# EAGLE design W640J (EAGLE 6.6.0)
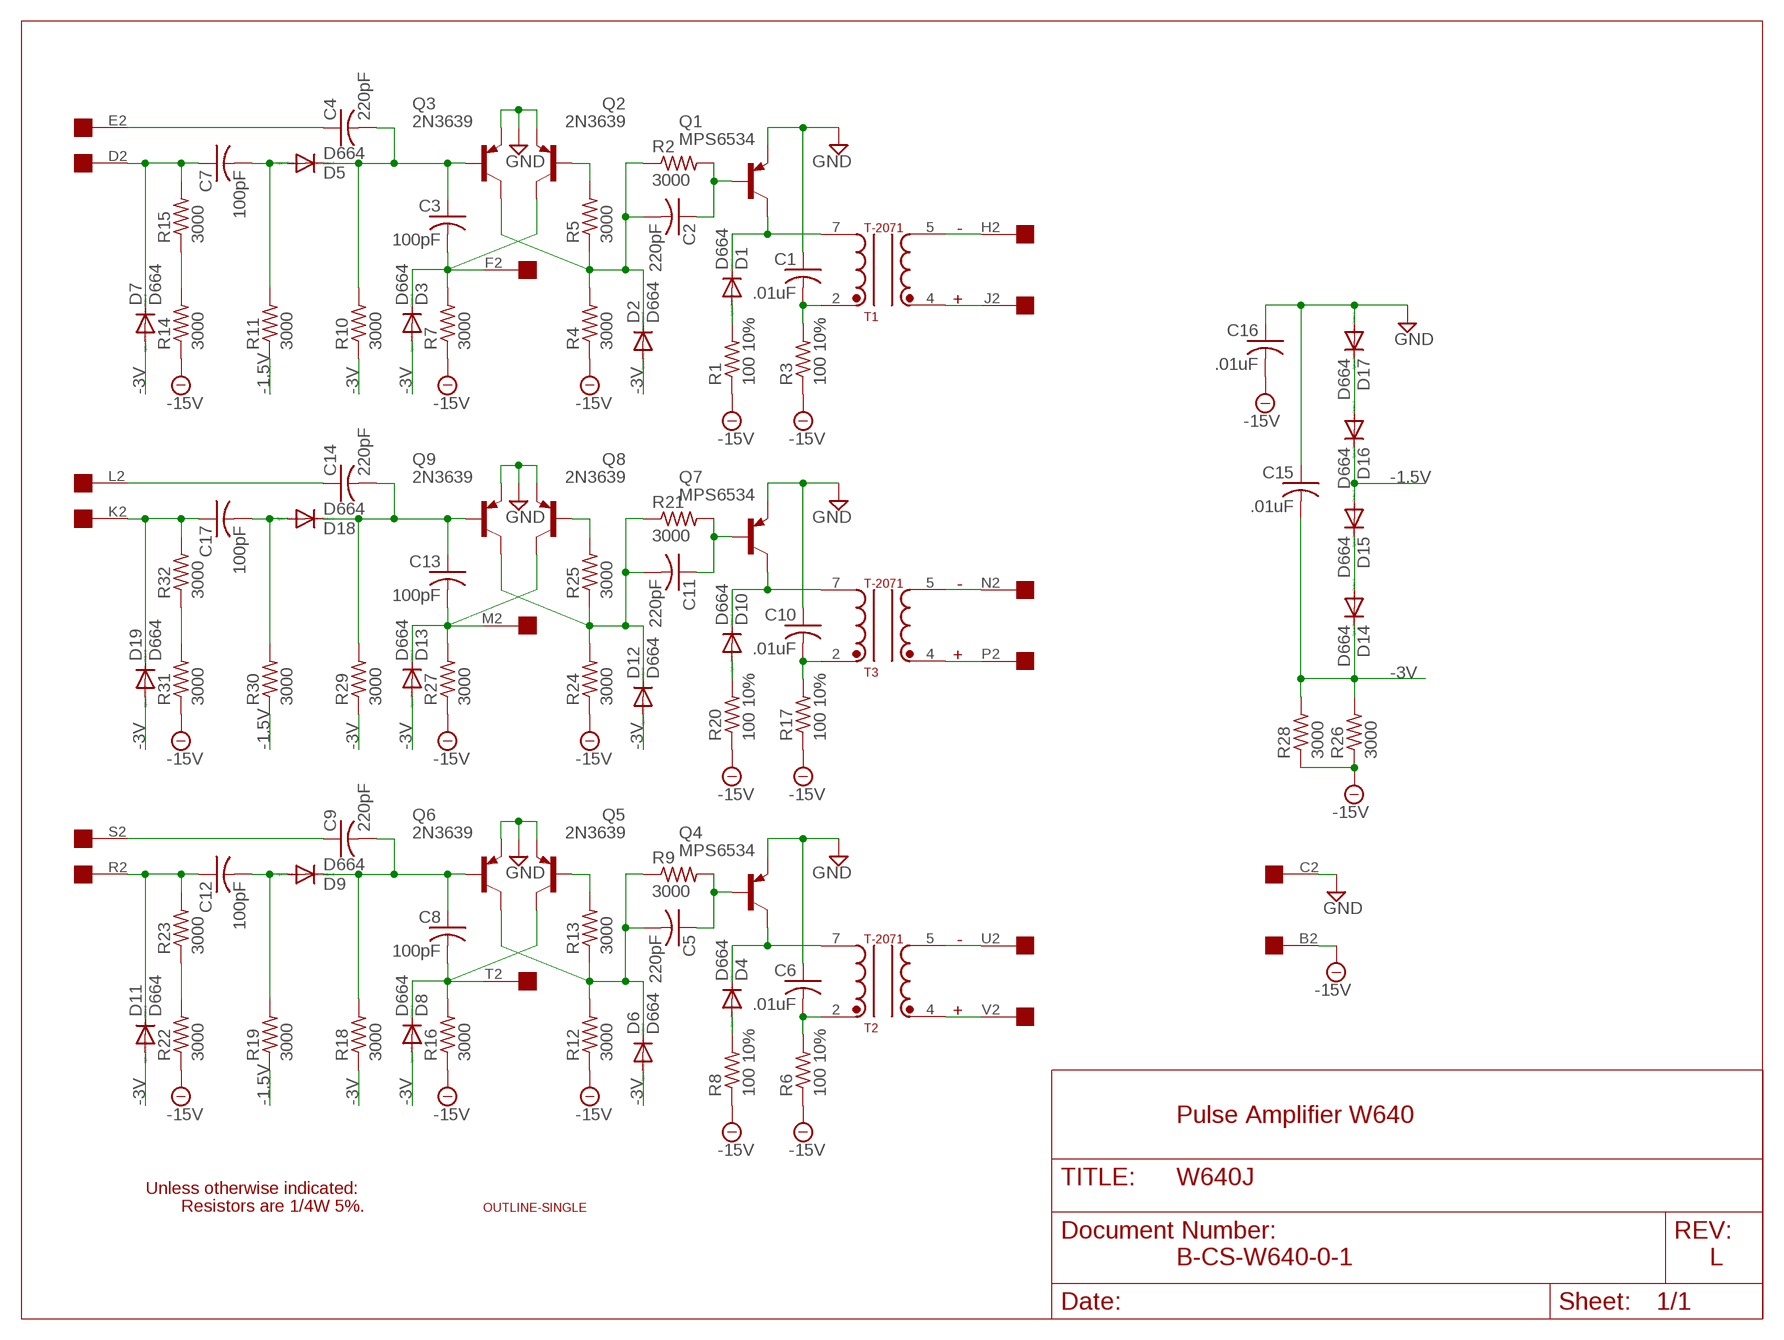
[diagram p0: schematic, sheet 1]

## Parts
C1  .01uF  C-US  [C063-025X075]
C2  220pF  C-US  [C063-025X075]
C3  100pF  C-US  [C063-025X075]
C4  220pF  C-US  [C063-025X075]
C5  220pF  C-US  [C063-025X075]
C6  .01uF  C-US  [C063-025X075]
C7  100pF  C-US  [C063-025X075]
C8  100pF  C-US  [C063-025X075]
C9  220pF  C-US  [C063-025X075]
C10  .01uF  C-US  [C063-025X075]
C11  220pF  C-US  [C063-025X075]
C12  100pF  C-US  [C063-025X075]
C13  100pF  C-US  [C063-025X075]
C14  220pF  C-US  [C063-025X075]
C15  .01uF  C-US  [C063-025X075]
C16  .01uF  C-US  [C063-025X075]
C17  100pF  C-US  [C063-025X075]
D1  D664  1N4148DO35-10  [DO35-10]
D2  D664  1N4148DO35-10  [DO35-10]
D3  D664  1N4148DO35-10  [DO35-10]
D4  D664  1N4148DO35-10  [DO35-10]
D5  D664  1N4148DO35-10  [DO35-10]
D6  D664  1N4148DO35-10  [DO35-10]
D7  D664  1N4148DO35-10  [DO35-10]
D8  D664  1N4148DO35-10  [DO35-10]
D9  D664  1N4148DO35-10  [DO35-10]
D10  D664  1N4148DO35-10  [DO35-10]
D11  D664  1N4148DO35-10  [DO35-10]
D12  D664  1N4148DO35-10  [DO35-10]
D13  D664  1N4148DO35-10  [DO35-10]
D14  D664  1N4148DO35-10  [DO35-10]
D15  D664  1N4148DO35-10  [DO35-10]
D16  D664  1N4148DO35-10  [DO35-10]
D17  D664  1N4148DO35-10  [DO35-10]
D18  D664  1N4148DO35-10  [DO35-10]
D19  D664  1N4148DO35-10  [DO35-10]
Q1  MPS6534  -PNP-TO5  [TO5]
Q2  2N3639  -PNP-TO5  [TO5]
Q3  2N3639  -PNP-TO5  [TO5]
Q4  MPS6534  -PNP-TO5  [TO5]
Q5  2N3639  -PNP-TO5  [TO5]
Q6  2N3639  -PNP-TO5  [TO5]
Q7  MPS6534  -PNP-TO5  [TO5]
Q8  2N3639  -PNP-TO5  [TO5]
Q9  2N3639  -PNP-TO5  [TO5]
R1  100 10%  R-US_0207/10  [0207/10]
R2  3000  R-US_0207/10  [0207/10]
R3  100 10%  R-US_0207/10  [0207/10]
R4  3000  R-US_0207/10  [0207/10]
R5  3000  R-US_0207/10  [0207/10]
R6  100 10%  R-US_0207/10  [0207/10]
R7  3000  R-US_0207/10  [0207/10]
R8  100 10%  R-US_0207/10  [0207/10]
R9  3000  R-US_0207/10  [0207/10]
R10  3000  R-US_0207/10  [0207/10]
R11  3000  R-US_0207/10  [0207/10]
R12  3000  R-US_0207/10  [0207/10]
R13  3000  R-US_0207/10  [0207/10]
R14  3000  R-US_0207/10  [0207/10]
R15  3000  R-US_0207/10  [0207/10]
R16  3000  R-US_0207/10  [0207/10]
R17  100 10%  R-US_0207/10  [0207/10]
R18  3000  R-US_0207/10  [0207/10]
R19  3000  R-US_0207/10  [0207/10]
R20  100 10%  R-US_0207/10  [0207/10]
R21  3000  R-US_0207/10  [0207/10]
R22  3000  R-US_0207/10  [0207/10]
R23  3000  R-US_0207/10  [0207/10]
R24  3000  R-US_0207/10  [0207/10]
R25  3000  R-US_0207/10  [0207/10]
R26  3000  R-US_0207/10  [0207/10]
R27  3000  R-US_0207/10  [0207/10]
R28  3000  R-US_0207/10  [0207/10]
R29  3000  R-US_0207/10  [0207/10]
R30  3000  R-US_0207/10  [0207/10]
R31  3000  R-US_0207/10  [0207/10]
R32  3000  R-US_0207/10  [0207/10]
T1  T-2071  T-2037  [TRANSFORMER]
T2  T-2071  T-2037  [TRANSFORMER]
T3  T-2071  T-2037  [TRANSFORMER]
U$1  OUTLINE-SINGLE  [SINGLE]
U$2  EDGE-1  [EDGE-CON1]

## Nets
-1.5V: D15.A D16.C R11.1 R19.1 R30.1
-3V: C15.2 D2.A D3.A D6.A D7.A D8.A D11.A D12.A D13.A D14.C D19.A R10.1 R18.1 R26.2 R28.2 R29.1
-15V: C16.2 R1.1 R3.1 R4.1 R6.1 R7.1 R8.1 R12.1 R14.1 R16.1 R17.1 R20.1 R22.1 R24.1 R26.1 R27.1 R28.1 R31.1 U$2.B2
GND [Supply]: C1.1 C6.1 C10.1 C15.1 C16.1 D17.A Q1.1(E) Q2.1(E) Q3.1(E) Q4.1(E) Q5.1(E) Q6.1(E) Q7.1(E) Q8.1(E) Q9.1(E) U$2.C2
N$1: Q2.2(B) R5.2
N$2: T3.5 U$2.N2
N$3: Q8.2(B) R25.2
N$4: Q5.2(B) R13.2
N$6: C3.1 C4.2 D5.C Q3.2(B) R10.2
N$7: D1.C Q1.3(C) T1.7
N$8: C1.2 R3.2 T1.2
N$9: C4.1 U$2.E2
N$10: T1.5 U$2.H2
N$11: C7.2 D5.A R11.2
N$12: T1.4 U$2.J2
N$13: C7.1 D7.C R15.2 U$2.D2
N$14: R14.2 R15.1
N$15: T3.4 U$2.P2
N$16: D10.C Q7.3(C) T3.7
N$17: C10.2 R17.2 T3.2
N$18: D10.A R20.2
N$19: C11.2 D12.C Q9.3(C) R21.1 R24.2 R25.1
N$20: C11.1 Q7.2(B) R21.2
N$22: C13.2 D13.C Q8.3(C) R27.2 U$2.M2
N$23: C13.1 C14.2 D18.C Q9.2(B) R29.2
N$24: C14.1 U$2.L2
N$25: C17.2 D18.A R30.2
N$26: C17.1 D19.C R32.2 U$2.K2
N$27: R31.2 R32.1
N$28: T2.5 U$2.U2
N$29: T2.4 U$2.V2
N$30: D4.C Q4.3(C) T2.7
N$31: D16.A D17.C
N$32: D14.A D15.C
N$33: C6.2 R6.2 T2.2
N$34: D1.A R1.2
N$35: C2.2 D2.C Q3.3(C) R2.1 R4.2 R5.1
N$36: C2.1 Q1.2(B) R2.2
N$38: D4.A R8.2
N$39: C3.2 D3.C Q2.3(C) R7.2 U$2.F2
N$40: C5.2 D6.C Q6.3(C) R9.1 R12.2 R13.1
N$41: C5.1 Q4.2(B) R9.2
N$43: C8.2 D8.C Q5.3(C) R16.2 U$2.T2
N$44: C8.1 C9.2 D9.C Q6.2(B) R18.2
N$45: C9.1 U$2.S2
N$46: C12.2 D9.A R19.2
N$47: C12.1 D11.C R23.2 U$2.R2
N$48: R22.2 R23.1
Unconnected: U$2.A2

## Notes on the sheet
- -
- +
- -
- +
- -
- +
- Pulse Amplifier W640
- Unless otherwise indicated:
- Resistors are 1/4W 5%.
- B-CS-W640-0-1 | L

## Library data of the parts
C1-C17 = dec-con:C-US: Capacitors with funky DEC lead spacing.
D1-D19 = diode:1N4148: DIODE high speed (Philips)
Q1-Q9 = transistor:*-PNP-: PNP Transistror
R1-R32 = rcl:R-US_: RESISTOR, American symbol
T1-T3 = dec-con:T-2037: T-2037 Transformer
U$1 = dec-con:OUTLINE-*: Board outlines for DEC boards.
U$2 = dec-con:EDGE-1: Single-Sided DEC Edge Connector -- (side 2)

## Net classes
0 default: width 0.711 mm
1 Supply: width 0.813 mm

## Board
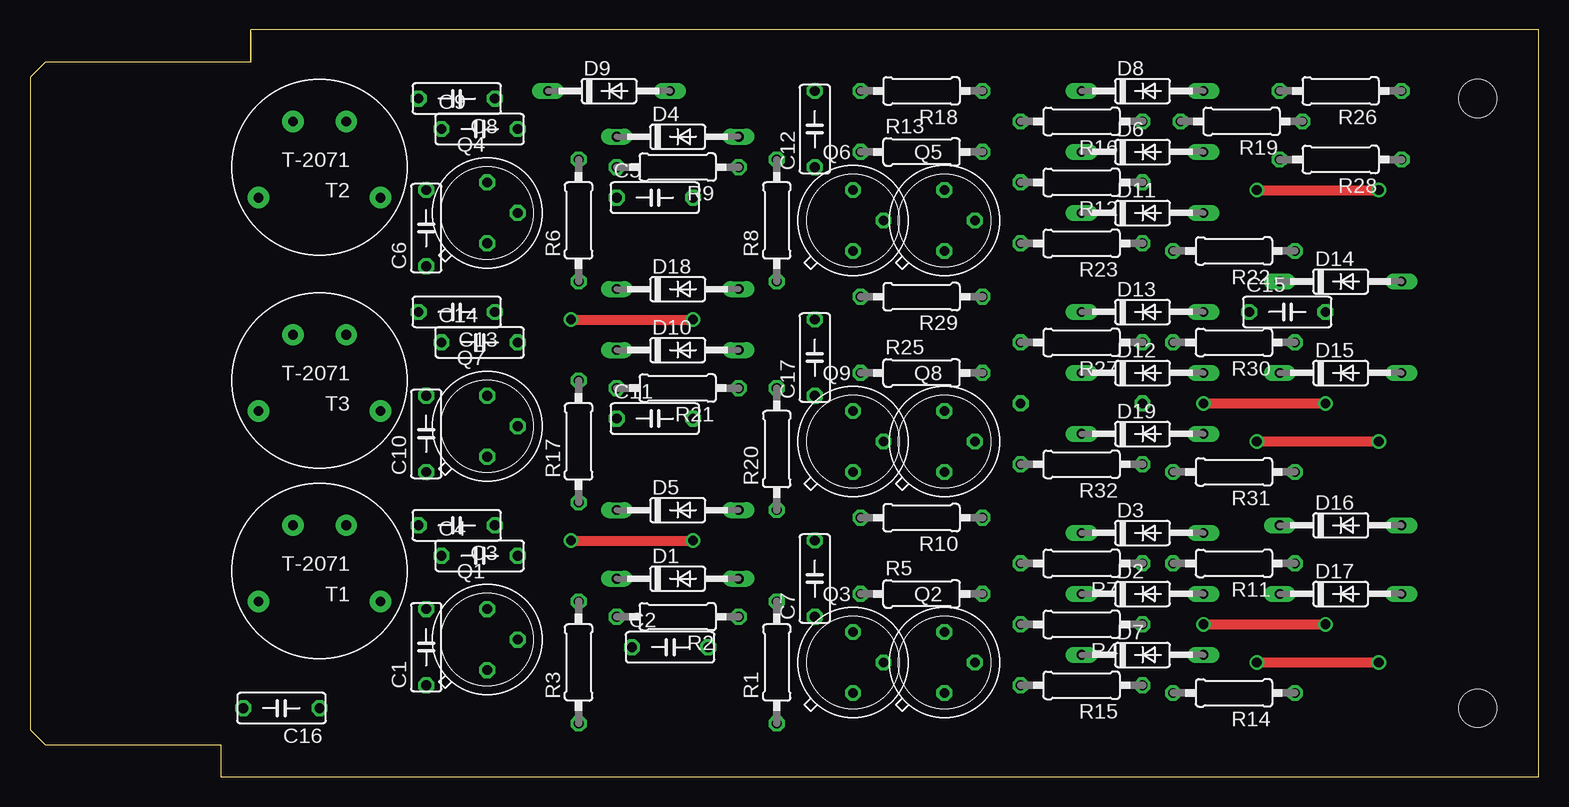
[diagram p1: board, top side]
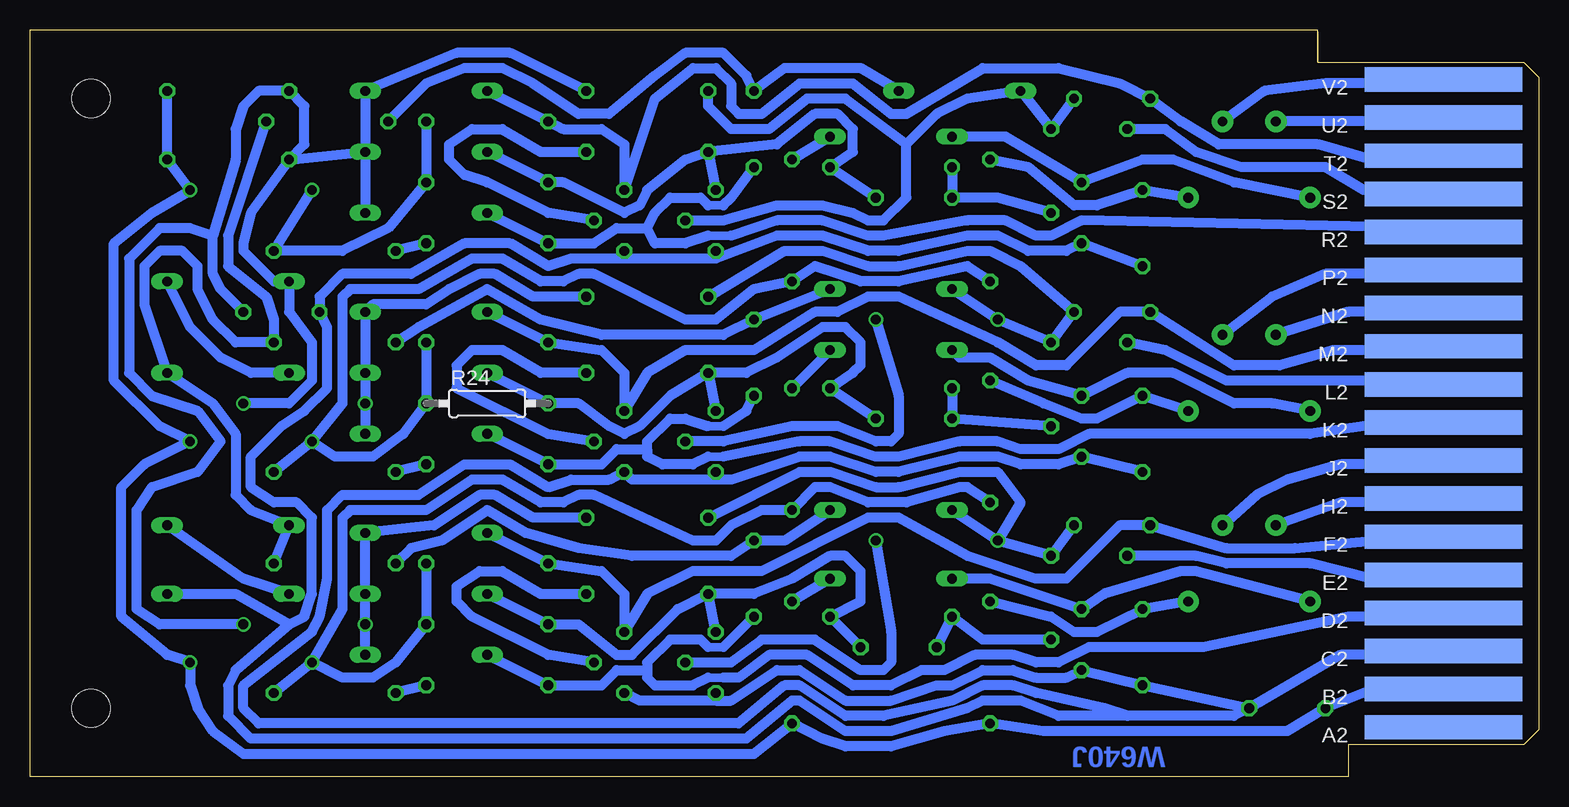
[diagram p2: board, bottom side, seen from below]

Size 125.73 x 62.23 mm. Coordinates in mm from the lower left corner, seen from the top.
Copper layers (1+16): Top 0.035mm / dielectric 1.5mm / Bottom 0.035mm
Design rules "16mils": minimum track width 16mil, minimum drill 32mil, track to track 15mil, track to pad 10mil, pad to pad 10mil, via to via 10mil, smd to smd 10mil, copper to edge 13mil, drill to drill 10mil, minimum pad ring 10mil, minimum via ring 8mil, stop-mask expansion 0mil, vias tented up to drill 0mil, thermal gap 10mil

### Footprints (pad centres in the part's own frame; a part is rotated, then mirrored left to right if it is on the bottom)
C063-025X075 = drill 0.813 octagon: 1 -2.54,0; 2 3.81,0
DO35-10 = drill 0.813 long: A 5.08,0; C -5.08,0
TO5 = drill 0.813 octagon: 1 0,-2.54; 2 2.54,0; 3 0,2.54
0207/10 = drill 0.813 octagon: 1 -5.08,0; 2 5.08,0
TRANSFORMER = drill 0.813 pad 1.778: 2 -5.08,2.54; 4 -2.223,-3.81; 5 2.223,-3.81; 7 5.08,2.54
SINGLE = hole 3.175: 120.65,56.515; 120.65,5.715
EDGE-CON1 = smd 13.106 x 2.032 bottom: A2 7.938,4.128; B2 7.938,7.303; C2 7.938,10.477; D2 7.938,13.652; E2 7.938,16.828; F2 7.938,20.003; H2 7.938,23.177; J2 7.938,26.352; K2 7.938,29.527; L2 7.938,32.703; M2 7.938,35.877; N2 7.938,39.053; P2 7.938,42.227; R2 7.938,45.403; S2 7.938,48.578; T2 7.938,51.752; U2 7.938,54.928; V2 7.938,58.102

### Placement (x,y rotation side)
C1  33.02,10.16 90 top
C2  52.71,10.79 0 top
C3  36.2,20.95 180 top
C4  36.83,18.41 0 top
C5  51.44,48.26 0 top
C6  33.02,45.09 90 top
C7  65.41,15.88 90 top
C8  36.2,56.52 180 top
C9  36.83,53.98 0 top
C10  33.02,27.94 90 top
C11  51.44,29.84 0 top
C12  65.41,53.34 90 top
C13  36.2,38.73 180 top
C14  36.83,36.2 0 top
C15  104.14,38.73 0 top
C16  21.59,5.71 180 top
C17  65.41,34.29 90 top
D1  53.98,16.51 0 top
D2  92.71,15.24 0 top
D3  92.71,20.32 0 top
D4  53.98,53.34 0 top
D5  53.98,22.23 0 top
D6  92.71,52.07 0 top
D7  92.71,10.16 0 top
D8  92.71,57.15 0 top
D9  48.26,57.15 0 top
D10  53.98,35.56 0 top
D11  92.71,46.99 0 top
D12  92.71,33.66 0 top
D13  92.71,38.73 0 top
D14  109.22,41.27 0 top
D15  109.22,33.66 0 top
D16  109.22,20.95 0 top
D17  109.22,15.24 0 top
D18  53.98,40.64 0 top
D19  92.71,28.57 0 top
Q1  38.1,11.43 0 top
Q2  76.2,9.53 0 top
Q3  68.58,9.53 0 top
Q4  38.1,46.99 0 top
Q5  76.2,46.35 0 top
Q6  68.58,46.35 0 top
Q7  38.1,29.21 0 top
Q8  76.2,27.94 0 top
Q9  68.58,27.94 0 top
R1  62.23,9.53 90 top
R2  53.98,13.34 180 top
R3  45.72,9.53 90 top
R4  87.63,12.7 180 top
R5  74.3,15.24 0 top
R6  45.72,46.35 90 top
R7  87.63,17.78 180 top
R8  62.23,46.35 90 top
R9  53.98,50.8 180 top
R10  74.3,21.59 180 top
R11  100.33,17.78 180 top
R12  87.63,49.53 180 top
R13  74.3,52.07 0 top
R14  100.33,6.99 180 top
R15  87.63,7.62 180 top
R16  87.63,54.61 180 top
R17  45.72,27.94 90 top
R18  74.3,57.15 180 top
R19  100.97,54.61 180 top
R20  62.23,27.3 90 top
R21  53.98,32.38 180 top
R22  100.33,43.81 180 top
R23  87.63,44.45 180 top
R24  87.63,31.11 0 bottom
R25  74.3,33.66 0 top
R26  109.22,57.15 180 top
R27  87.63,36.2 180 top
R28  109.22,51.44 180 top
R29  74.3,40.01 180 top
R30  100.33,36.2 180 top
R31  100.33,25.4 180 top
R32  87.63,26.04 180 top
T1  24.13,17.14 180 top
T2  24.13,50.8 180 top
T3  24.13,33.02 180 top
U$1  0,0 0 top
U$2  0,0 0 top

### Tracks (layer width: path | path; a pad name or v marks a point on that pad's centre or on a via)
-1.5V
  Bottom 0.813: R19.1 109.22,45.09 109.22,42.55 106.05,40.01 105.41,38.1 R30.1 108.59,36.2 110.49,38.1 111.76,40.64 111.76,42.55 113.03,43.81 114.94,43.81 116.21,42.55 116.21,39.37 D15.A 110.49,31.11 108.59,28.57 108.59,23.5 107.32,22.23 D16.C R11.1
-3V  (via drill 0.81)
  Top 0.813: v97.79,12.7 v107.95,12.7 | v97.79,31.11 v107.95,31.11
  Bottom 0.813: D7.A v97.79,12.7 D2.A D3.A 92.08,20.95 88.27,23.5 87,23.5 83.82,21.59 R10.1 | v107.95,12.7 114.94,12.7 116.84,13.97 116.84,22.23 115.57,24.13 111.76,25.4 109.86,27.94 111.76,30.48 115.57,31.75 117.48,33.66 117.48,43.18 114.94,45.72 112.4,45.72 110.49,45.09 | D19.A v97.79,31.11 D12.A D13.A 97.16,39.37 92.71,39.37 90.81,40.64 88.27,41.91 87,41.91 83.82,40.01 R29.1 | R18.1 85.73,60.33 90.17,60.33 D8.A D6.A | D6.A D11.A | R28.2 102.87,52.7 102.87,55.88 R26.2 106.68,57.15 107.95,55.88 108.59,53.98 108.59,51.44 110.49,45.09 | R28.2 D6.A | v107.95,31.11 104.14,31.11 102.24,33.02 102.24,36.2 104.14,38.73 D14.C 105.41,41.27 107.95,43.81 107.95,44.45 107.32,46.99 R28.2 | C15.2 109.86,40.64 110.49,41.91 110.49,45.09
-15V  (via drill 0.81)
  Top 0.813: v102.24,9.53 v112.4,9.53 | v102.24,48.9 v112.4,48.9 | v102.24,27.94 v112.4,27.94
  Bottom 0.813: U$2.B2 8.26,6.99 14.61,6.99 C16.2 20.96,3.81 41.28,3.81 R3.1 49.53,3.81 53.98,2.54 57.79,2.54 59.69,3.17 R1.1 65.41,1.91 107.95,1.91 110.49,3.81 111.76,5.71 112.4,7.62 v112.4,9.53 114.3,10.16 118.11,13.34 118.11,24.13 116.21,26.04 v112.4,27.94 114.94,29.21 118.75,33.02 118.75,44.45 115.57,46.99 v112.4,48.9 R28.1 R26.1 | R14.1 v102.24,9.53 | v102.24,9.53 99.7,8.26 97.16,8.26 95.25,9.53 R4.1 R7.1 | R16.1 R12.1 95.89,45.72 99.7,43.81 R22.1 v102.24,48.9 | v102.24,27.94 100.33,26.67 97.16,26.67 94.62,28.57 R24.1 R27.1 | R31.1 v102.24,27.94 | R17.1 47.63,24.13 48.26,24.13 52.71,22.86 55.88,22.86 59.06,24.13 60.33,24.13 R20.1 64.77,22.23 67.31,20.95 68.58,19.68 70.49,19.68 78.74,23.5 80.01,23.5 81.28,22.86 83.19,22.86 86.36,24.77 88.9,24.77 92.71,22.23 99.06,22.23 99.7,21.59 99.7,13.97 v102.24,9.53 | R6.1 47.63,42.55 53.34,41.27 56.52,41.27 60.33,42.55 R8.1 65.41,40.64 68.58,38.1 71.12,38.1 78.74,41.91 80.01,41.91 81.28,41.27 83.19,41.27 86.36,43.18 88.9,43.18 93.35,40.64 99.06,40.64 99.7,40.01 99.7,31.11 v102.24,27.94
GND
  Bottom 0.813: U$2.C2 8.89,10.16 16.51,10.16 C16.1 | C16.1 C1.1 Q1.1 39.37,8.26 41.91,8.26 43.82,8.89 46.36,8.89 48.9,7.62 50.17,7.62 53.98,6.35 57.79,6.35 61.6,8.89 63.5,8.89 67.31,6.35 68.58,6.35 | 68.58,6.35 74.93,6.35 Q2.1 | Q3.1 68.58,6.35 | C16.1 25.4,5.08 34.29,5.08 | 34.29,5.08 36.2,5.71 41.91,6.99 43.82,7.62 46.36,7.62 48.9,6.35 54.61,5.08 57.79,5.08 61.6,7.62 62.87,7.62 66.68,4.45 106.68,4.45 107.95,5.71 107.95,7.62 102.24,12.06 101.6,13.34 100.97,16.51 100.97,22.23 99.7,23.5 93.35,23.5 89.54,26.04 85.73,26.04 82.55,24.13 80.65,24.77 77.47,24.77 Q8.1 75.57,24.77 68.58,24.77 | 34.29,5.08 40.01,5.08 43.18,6.35 46.36,6.35 47.63,5.71 53.98,3.81 57.79,3.81 61.6,6.35 62.23,6.35 66.04,3.17 107.32,3.17 109.22,5.08 109.22,7.62 108.59,8.89 104.14,12.7 | C10.1 Q7.1 40.01,26.04 43.18,26.04 45.09,26.67 48.26,26.67 53.34,25.4 55.25,25.4 59.06,26.67 61.6,26.67 67.31,24.77 68.58,24.77 | Q9.1 68.58,24.77 | Q6.1 68.58,43.18 | 68.58,43.18 76.2,43.18 | 76.2,43.18 Q5.1 | D17.A 108.59,15.24 104.14,12.7 | C6.1 Q4.1 39.37,43.81 42.55,43.81 45.09,45.09 47.63,45.09 53.34,43.81 55.88,43.81 59.69,45.09 63.5,45.09 68.58,43.18 | 104.14,12.7 102.87,13.34 102.24,15.24 102.24,21.59 103.51,22.86 105.41,22.86 107.32,24.13 107.32,26.67 104.78,29.21 102.87,30.48 100.97,32.38 100.97,37.47 C15.1 101.6,40.01 99.7,41.91 93.98,41.91 89.54,44.45 85.73,44.45 82.55,42.55 80.65,43.18 76.2,43.18
N$1
  Bottom 0.813: Q2.2 82.55,10.16 88.9,13.34 90.17,14.61 90.17,15.88 88.27,17.14 86.36,17.14 83.19,15.24 R5.2
N$2
  Bottom 0.813: U$2.N2 9.53,38.73 15.88,38.73 T3.5
N$3
  Bottom 0.813: R25.2 83.19,33.66 86.36,35.56 88.9,35.56 90.17,34.29 90.17,32.38 82.55,28.57 Q8.2
N$4
  Bottom 0.813: Q5.2 82.55,46.99 87.63,49.53 89.54,50.16 90.81,51.44 90.81,52.7 88.9,53.98 86.36,53.98 83.19,52.07 R13.2
N$6  (via drill 0.81)
  Top 0.813: v45.09,19.68 v55.25,19.68
  Bottom 0.813: C3.1 C4.2 v45.09,19.68 | v55.25,19.68 53.98,12.06 53.98,9.53 54.61,8.89 56.52,8.89 60.33,11.43 64.77,11.43 67.31,9.53 Q3.2 | D5.C v45.09,19.68 | R10.2 61.6,25.4 59.06,25.4 55.25,24.13 53.34,24.13 48.26,25.4 45.09,25.4 43.18,22.86 v45.09,19.68
N$7
  Bottom 0.813: T1.7 28.58,17.14 29.85,17.14 36.2,15.24 Q1.3 45.72,16.51 D1.C
N$8
  Bottom 0.813: T1.2 C1.2 36.83,12.06 38.74,12.06 40.64,13.34 R3.2
N$9
  Bottom 0.813: U$2.E2 9.53,16.51 13.97,16.51 19.05,17.78 26.04,17.78 28.58,18.41 C4.1
N$10
  Bottom 0.813: U$2.H2 9.53,22.86 16.51,22.86 T1.5
N$11
  Bottom 0.813: D5.A 62.87,19.68 C7.2 67.31,18.41 75.57,18.41 80.01,19.05 84.46,20.32 87.63,22.23 91.44,19.68 93.98,19.05 R11.2
N$12
  Bottom 0.813: U$2.J2 8.89,26.04 16.51,26.04 20.96,24.77 23.5,23.5 T1.4
N$13
  Bottom 0.711: 67.95,10.79 69.22,10.79 | 67.95,8.26 69.22,8.26
  Bottom 0.813: D7.C R15.2 78.11,7.62 76.84,8.89 74.3,8.89 | 74.3,8.89 74.3,8.26 73.66,7.62 70.49,7.62 69.22,8.26 | 69.22,10.79 69.85,11.43 72.39,11.43 74.3,9.53 74.3,8.89 | U$2.D2 8.89,13.34 15.88,13.34 27.94,10.79 37.47,10.79 40.01,9.53 41.91,9.53 43.82,10.16 46.99,10.16 49.53,8.89 51.44,8.89 53.98,7.62 57.15,7.62 60.96,10.16 64.14,10.16 66.68,8.26 67.95,8.26 | C7.1 67.95,10.79
N$14
  Bottom 0.813: R15.1 R14.2
N$15
  Bottom 0.813: U$2.P2 9.53,41.91 17.78,41.91 22.23,40.01 T3.4
N$16
  Bottom 0.813: T3.7 22.23,31.11 25.4,31.11 30.48,33.66 34.29,33.66 Q7.3 42.55,33.02 45.72,34.92 48.26,34.92 D10.C
N$17
  Bottom 0.813: T3.2 C10.2 36.83,29.84 38.1,29.84 41.28,31.11 R17.2
N$18
  Bottom 0.813: D10.A R20.2
N$19
  Bottom 0.813: C11.2 R21.1 57.15,33.66 56.52,34.29 56.52,36.2 57.79,37.47 59.69,37.47 63.5,34.92 66.04,33.66 R25.1 | R25.1 Q9.3 | R25.1 72.39,31.75 74.93,29.21 76.2,28.57 77.47,29.21 80.01,31.11 R24.2 D12.C
N$20
  Bottom 0.813: Q7.2 C11.1 R21.2
N$22
  Bottom 0.813: U$2.M2 8.89,35.56 17.15,35.56 21.59,34.29 25.4,34.29 C13.2 34.93,38.73 39.37,34.29 41.91,34.29 45.09,36.2 53.34,40.01 55.88,40.01 58.42,38.73 60.33,38.73 65.41,35.56 71.12,35.56 74.3,33.66 Q8.3 76.2,33.66 78.11,35.56 R27.2 D13.C
N$23  (via drill 0.81)
  Top 0.813: v45.09,38.1 v55.25,38.1
  Bottom 0.813: v55.25,38.1 53.34,31.75 53.34,28.57 53.98,27.94 55.25,27.94 58.42,29.21 62.23,29.21 67.95,27.94 Q9.2 | D18.C v45.09,38.1 C14.2 C13.1 43.18,42.55 45.72,43.81 47.63,43.81 53.34,42.55 55.88,42.55 59.69,43.81 62.87,43.81 R29.2
N$24
  Bottom 0.813: U$2.L2 8.26,33.02 26.04,33.02 31.12,35.56 C14.1
N$25
  Bottom 0.813: D18.A C17.2 67.95,36.83 78.11,36.83 83.19,38.1 87.63,40.64 93.35,37.47 R30.2
N$26
  Bottom 0.711: 67.95,26.67 69.22,26.67 | 69.22,29.21 67.95,29.21
  Bottom 0.813: U$2.K2 8.89,29.21 14.61,29.21 19.05,28.57 37.47,28.57 40.01,27.3 43.18,27.3 45.09,27.94 48.26,27.94 53.34,26.67 55.25,26.67 59.06,27.94 61.6,27.94 67.95,26.67 | 69.22,26.67 70.49,26.04 73.03,26.04 74.3,26.67 74.3,27.3 | 74.3,27.3 74.3,27.94 72.39,29.84 71.12,29.84 69.22,29.21 | 67.95,29.21 66.04,30.48 C17.1 | 74.3,27.3 76.84,27.3 78.11,26.04 R32.2 D19.C
N$27
  Bottom 0.813: R32.1 R31.2
N$28
  Bottom 0.813: U$2.U2 8.89,54.61 T2.5
N$29
  Bottom 0.813: U$2.V2 8.89,57.78 17.78,57.78 22.86,57.15 T2.4
N$30
  Bottom 0.813: T2.7 25.4,49.53 30.48,51.44 33.02,51.44 Q4.3 44.45,53.34 D4.C
N$31
  Bottom 0.813: D17.C 107.95,16.51 D16.A
N$32
  Bottom 0.813: D15.C 107.32,33.66 109.86,34.92 112.4,37.47 D14.A
N$33
  Bottom 0.813: T2.2 C6.2 36.83,47.62 38.74,47.62 42.55,50.8 R6.2
N$34
  Bottom 0.813: D1.A R1.2
N$35
  Bottom 0.813: C2.2 R2.1 56.52,14.61 56.52,17.14 57.79,18.41 59.06,18.41 62.23,16.51 65.41,15.24 R5.1 | Q3.3 R5.1 | D2.C R4.2 80.01,12.7 76.84,10.16 75.57,10.16 71.76,13.97 R5.1
N$36
  Bottom 0.813: Q1.2 46.36,11.43 R2.2 C2.1
N$38
  Bottom 0.813: D4.A R8.2
N$39
  Bottom 0.813: U$2.F2 8.26,19.68 13.97,19.68 20.32,19.05 26.04,19.05 C3.2 34.93,20.95 39.37,16.51 41.91,16.51 47.63,18.41 53.34,21.59 55.88,21.59 64.77,17.14 70.49,17.14 74.3,15.24 Q2.3 76.2,15.24 78.11,17.14 R7.2 D3.C
N$40
  Bottom 0.813: R13.1 Q6.3 | C5.2 R9.1 57.15,52.07 57.15,53.98 58.42,55.24 60.33,55.24 63.5,52.7 R13.1 | R13.1 71.12,51.44 74.3,48.9 74.93,47.62 76.2,46.99 81.28,49.53 R12.2 D6.C
N$41
  Bottom 0.813: R9.2 C5.1 45.09,48.26 Q4.2
N$43
  Bottom 0.813: U$2.T2 8.89,51.44 13.97,51.44 18.42,52.7 26.67,52.7 29.85,54.61 C8.2 34.93,57.78 40.01,59.05 46.36,59.05 52.71,55.24 53.98,55.24 57.15,57.78 61.6,57.78 64.77,55.24 66.68,55.24 67.31,55.88 67.31,57.78 68.58,59.05 70.49,59.05 73.66,56.52 Q5.3 76.2,52.7 78.11,53.98 81.28,53.98 R16.2 D8.C
N$44
  Bottom 0.813: C8.1 C9.2 D9.C 47.63,56.52 50.17,55.24 52.71,52.7 | 52.71,52.7 57.79,56.52 60.96,56.52 64.14,53.98 67.31,53.98 69.22,55.88 R18.2 | Q6.2 67.95,46.35 63.5,47.62 59.69,47.62 57.15,46.99 55.88,46.35 54.61,46.35 52.71,48.26 52.71,52.7
N$45
  Bottom 0.813: U$2.S2 9.53,48.9 14.61,48.9 17.78,50.8 24.77,50.8 28.58,52.07 31.12,53.98 C9.1
N$46
  Bottom 0.813: D9.A 56.52,59.05 62.87,59.05 C12.2 66.04,58.42 67.95,60.33 71.12,60.33 73.66,58.42 77.47,55.24 80.01,55.24 83.82,57.78 86.36,59.05 89.54,59.05 92.71,57.78 R19.2
N$47
  Bottom 0.711: 67.31,45.09 69.22,45.09 | 69.22,47.62 67.95,47.62
  Bottom 0.813: U$2.R2 8.26,45.72 38.1,46.35 40.64,45.09 41.91,45.09 44.45,46.35 47.63,46.35 54.61,45.09 55.88,45.09 59.69,46.35 63.5,46.35 67.31,45.09 | 69.22,45.09 71.12,44.45 73.66,44.45 74.3,45.72 | 74.3,45.72 73.66,46.99 72.39,48.26 69.85,48.26 69.22,47.62 | 67.95,47.62 67.31,48.26 C12.1 | D11.C R23.2 78.74,44.45 76.84,45.72 74.3,45.72
N$48
  Bottom 0.813: R23.1 R22.2

### Text on the board
Bottom: W640J